# Altium schematic sheet PSU_2.SchDoc: POWER SUPPLY
size A4; Date: 30 08 2013; Author: Rachid AKKOUCHE; CompanyName: MDI; DrawnBy: Rachid AKKOUCHE; Engineer: Rachid AKKOUCHE; Organization: RASoftware; Address1: 52 J03, rue de la crèche; Address2: 77100 MEAUX; Address3: FRANCE; DocumentNumber: BRA201308308C; Revision: C; SheetNumber: 8; SheetTotal: 11; Telephone: +33651604047; Email: rachid.akkouche@wanadoo.fr; Proprietaire: MDI System; Dessinepar: -; Verifiepar: -; Time: 19:00
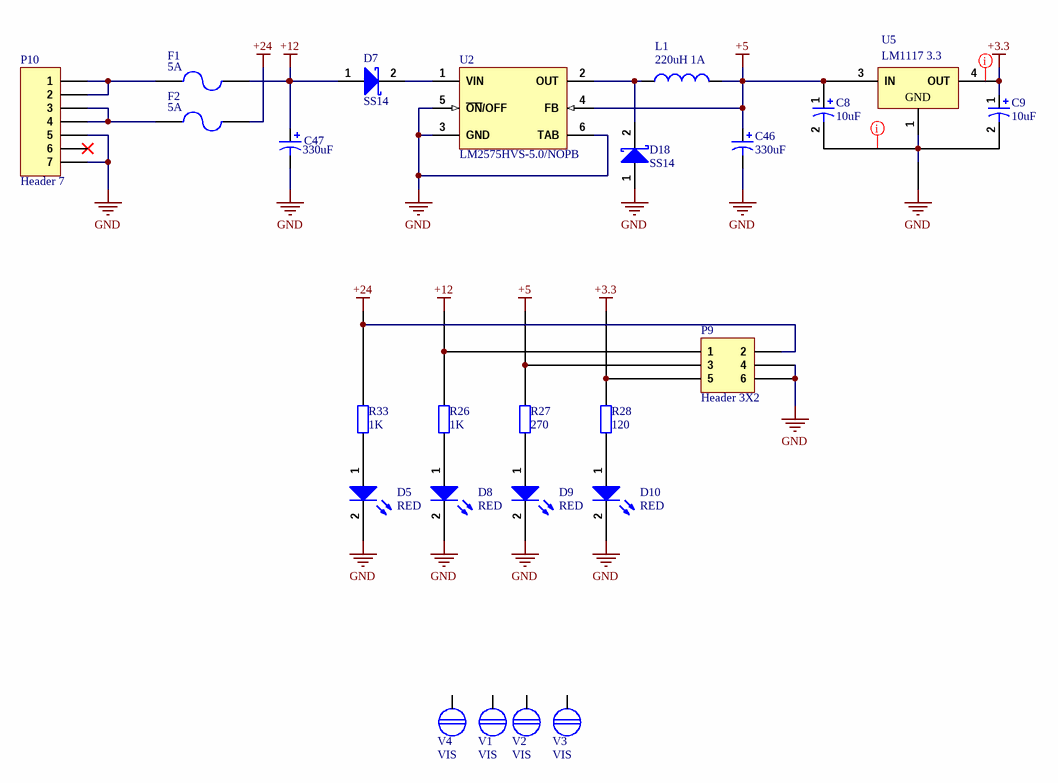
[diagram p0: PSU_2.SchDoc]

## Parts
C8  10uF  [KEMET_4]
C9  10uF  [KEMET_4]
C46  330uF  [Kemet_10]
C47  330uF  [Kemet_10]
D5  Couleur: RED  [0603-LEDR]  (hidden comment: HSMH-C190)
D7  SS14  [DO220AA]
D8  Couleur: RED  [0603-LEDR]  (hidden comment: HSMH-C190)
D9  Couleur: RED  [0603-LEDR]  (hidden comment: HSMH-C190)
D10  Couleur: RED  [0603-LEDR]  (hidden comment: HSMH-C190)
D18  SS14  [DO220AA]
F1  5A  [FUS5X20]
F2  5A  [FUS5X20]
L1  220uH 1A  [Self MCB 18X15]
P9  Header 3X2  [M20-2X3]
P10  Header 7  [CO7P508]
R26  1K  [R0805]
R27  270  [R0805]
R28  120  [R0805]
R33  1K  [R0805]
U2  LM2575HVS-5.0/NOPB  [TO263-5]
U5  LM1117 3.3  [TO252]
V1  VIS  [VIS42]
V2  VIS  [VIS42]
V3  VIS  [VIS42]
V4  VIS  [VIS42]

## Nets
+3.3: C9.1 P9.5 R28.2 U5.4(OUT)
+5: C8.1 C46.1 L1.2 P9.3 R27.2 U2.4(FB) U5.3(IN)
+12: C47.1 D7.1(A) F1.2 P9.1 R26.2
+24: F2.2 P9.2 R33.2
GND: C8.2 C9.2 C46.2 C47.2 D5.2(K) D8.2(K) D9.2(K) D10.2(K) D18.1(A) P9.4 P9.6 P10.5 P10.7 U2.3(GND) U2.5(~{ON}/OFF) U2.6(TAB) U5.1(GND)
NetD5_1: D5.1(A) R33.1
NetD7_2: D7.2(K) U2.1(VIN)
NetD8_1: D8.1(A) R26.1
NetD9_1: D9.1(A) R27.1
NetD10_1: D10.1(A) R28.1
NetD18_2: D18.2(K) L1.1 U2.2(OUT)
NetF1_1: F1.1 P10.1 P10.2
NetF2_1: F2.1 P10.3 P10.4

Not connected (* = marked no-connect by the designer): P10 6*; V1 1; V2 1; V3 1; V4 1

## Layout directives
rule Width Constraint [Pref Width = 0.55mm    Min Width = 0.254mm    Max Width = 2mm]: +3.3, GND

## Notes on the sheet
- Ce document est la propriété de
- Project:
- Il ne peut être divulgué sans l'accord écrit de l'un de ses représentants dûment mandaté
- Title:
- Number:
- Date:
- Time:
- Size:
- A4
- Revision:
- Sheet
- of
- 52 J03 rue de la crèche
- Draw by:
- 77100 Meaux

## Library data of the parts
C8 C9 = Cap Pol1: Polarized Capacitor; Manufacturer: KEMET; Manufacturer Part Number: EXV106M025A9BAA; Supplier 1: Farnell; Supplier Part Number 1: 2069174; RoHS: YES; Pricing 1: 10=0,111, 100=0,085, 500=0,074, 1000=0,07, 5000=0,066 (EUR); ComponentLink1URL: http://www.farnell.com/datasheets/1500293.pdf; ComponentLink1Description: http://www.farnell.com/datasheets/1500293.pdf
C46 C47 = Cap Pol1: Polarized Capacitor (Radial); Manufacturer: KEMET; Manufacturer Part Number: EDK337M025A9PAA; Value: 330uF; Supplier 1: Farnell; Supplier Part Number 1: 2068668; RoHS: YES; Stock 1: 2680; Pricing 1: 10=0,243, 100=0,212, 500=0,191, 1000=0,17, 5000=0,153 (EUR); ComponentLink1URL: http://www.farnell.com/datasheets/1680956.pdf; ComponentLink1Description: http://www.farnell.com/datasheets/1680956.pdf
  C47: Published: 8-Jun-2000; LatestRevisionDate: 17-Jul-2002; LatestRevisionNote: Re-released for DXP Platform.; PackageReference: RB7.6-15; Publisher: Altium Limited; PackageDescription: Polarized Capacitor (Radial); 2 Leads
D5 D8-D10 = HSMH-C190: Surface Mount Chip LED, Red; Manufacturer: AVAGO TECHNOLOGIES; Manufacturer Part Number: HSMH-C190.; Taille de lampe: 0.8mm x 1; Couleur de LED: Rouge; Intensité lumineuse: 17; Angle, vision: 170°; Courant, direct, If: 20; Tension, direct à  If: 1.8; Montage LED: CMS; Forme de lentille: Rectangulaire; Longueur d'onde typ.: 626; SVHC: No SVHC (19-Dec-2012); Dissipation de puissance: 65; Intensité lumineuse min. à  If: 2.8; Intensité lumineuse typique: 10; Largeur (externe): 0.8; Longueur d'onde dominante: 639; Longueur d'onde, crête: 630; Longueur/hauteur: 1.6; Matière: AlGaAs; Nombre de broches: 2; Orientation de montage opto: Dessus; Orientation sortie de lumière: Top Emitting; Température de fonctionnement: -30°C à +85; Température de fonctionnement max..: 85; Température, stockage min.: -40; Température d'utilisation min: -30; Tension, Vf max..: 2.6; Tension, Vf min.: 2.1; Type de LED: Standard; Supplier 1: Farnell; Supplier Part Number 1: 8554641; RoHS: YES; Stock 1: 13902; Pricing 1: 5=0,06, 25=0,059, 100=0,057, 250=0,052, 500=0,047 (EUR); MSL: MSL 2A - 4 semaines; Couleur, LED: Rouge; Profondeur: 0.8; Température, stockage max..: 85; Tension, Vf typ.: 1.8; ComponentLink1URL: http://www.farnell.com/datasheets/313031.pdf; ComponentLink1Description: http://www.farnell.com/datasheets/313031.pdf; ComponentLink2URL: http://www.farnell.com/datasheets/55927.pdf; ComponentLink2Description: http://www.farnell.com/datasheets/55927.pdf
D7 D18 = D Schottky: Schottky Diode
F1 F2 = Fuse 2: Fuse; Manufacturer: KEYSTONE; Manufacturer Part Number: 4527; Fusible 5X20: 1123209; Published: 8-Jun-2000; LatestRevisionDate: 17-Jul-2002; LatestRevisionNote: Re-released for DXP Platform.; PackageReference: PIN-W2/E2.8; Publisher: Altium Limited; PackageDescription: Thru-Hole; 2 Leads; Supplier 1: Farnell; Supplier Part Number 1: 2301274+2301275+1123183; RoHS: YES; Pricing 1: 1=0,59, 250=0,45, 500=0,4, 1000=0,36, 5000=0,33 (EUR); ComponentLink1URL: http://www.keyelco.com/userAssets/file/M60p42.pdf; ComponentLink1Description: http://www.keyelco.com/userAssets/file/M60p42.pdf
L1 = Inductor: Manufacturer: MULTICOMP; Manufacturer Part Number: MCBFS7330-221MU; Gamme de produit: MULTICOMP - MCB Series; Inductance: 220; Tolérance d'Inductance: ± 20%; Construction inductance: Blindé; Résistance DC max.: 0.47; Courant efficace (Irms): 1.2; Type de packaging: Bande découpée; Largeur (externe): 15.24; Longueur/hauteur: 18.54; Nombre de broches: 2; Pas: 12.7; Profondeur: 7.62; Série: MCB<!--FANDB--><div class="features-and-benefits-container"></div>; Supplier 1: Farnell; Supplier Part Number 1: 1864291; RoHS: YES; Stock 1: 2348; Pricing 1: 5=0,37, 50=0,32, 100=0,27, 500=0,25, 1000=0,22 (EUR); Dimensions Boîtier: 18.54mm x 15.24mm x 7.62; ComponentLink1URL: http://www.farnell.com/datasheets/1684913.pdf; ComponentLink1Description: http://www.farnell.com/datasheets/1684913.pdf
P9 = Header 3X2: Header, 3-Pin, Dual row; Manufacturer: TE CONNECTIVITY / AMP; Manufacturer Part Number: 1241050-3; LatestRevisionDate: 17-Jul-2002; LatestRevisionNote: Re-released for DXP Platform.; Publisher: Altium Limited; Supplier 1: Farnell; Supplier Part Number 1: 9689567; RoHS: YES; Pricing 1: 1=1,26, 10=1,22, 50=1,2, 100=1,16 (EUR); ComponentLink1URL: http://www.tycoelectronics.com/commerce/DocumentDelivery/DDEController?Action=srchrtrv&DocNm=1241050-3&DocType=Customer+View+Model&DocLang=English; ComponentLink1Description: http://www.tycoelectronics.com/commerce/DocumentDelivery/DDEController?Action=srchrtrv&DocNm=1241050-3&DocType=Customer+View+Model&DocLang=English; ComponentLink2URL: http://www.te.com/commerce/DocumentDelivery/DDEController?Action=showdoc&DocId=Customer+Drawing%7F1241050%7FA9%7Fpdf%7FEnglish%7FENG_CD_1241050_A9.pdf%7F1241050-5; ComponentLink2Description: http://www.te.com/commerce/DocumentDelivery/DDEController?Action=showdoc&DocId=Customer+Drawing%7F1241050%7FA9%7Fpdf%7FEnglish%7FENG_CD_1241050_A9.pdf%7F1241050-5; ComponentLink3URL: http://www.farnell.com/datasheets/318453.pdf; ComponentLink3Description: http://www.farnell.com/datasheets/318453.pdf
P10 = Header 7: Header, 7-Pin; LatestRevisionDate: 17-Jul-2002; LatestRevisionNote: Re-released for DXP Platform.; Publisher: Altium Limited
R26 R28 R33 = Resistor 0805 1K: Resistor; Manufacturer: MULTICOMP; Manufacturer Part Number: MC0.1W08051%1KFR; Product Range: MULTICOMP - MC Series; Résistance: 1; Puissance: 100; Tolérance de résistance: ± 1%; Type de boîtier de résistance: 0805; Type de résistance: Couche épaisse; Coefficient de température: ± 100; Tension: 150; Type de packaging: Full Reel; Resistor Mounting: CMS; Supplier 1: Farnell; RoHS: YES; Pricing 1: 5000=0,001 (EUR); MSL: MSL 1 - Illimité; ComponentLink1URL: http://www.farnell.com/datasheets/1716700.pdf; ComponentLink1Description: http://www.farnell.com/datasheets/1716700.pdf; Supplier Part Number 1: 2129113
R27 = Resistor 0805 270: Resistor; Manufacturer: MULTICOMP; Manufacturer Part Number: MC01W08051270R; Product Range: MULTICOMP - MC Series; Puissance: 100; Tolérance de résistance: ± 1%; Type de boîtier de résistance: 0805; Type de résistance: Couche épaisse; Coefficient de température: ± 100; Tension: 150; Type de packaging: Full Reel; SVHC: No SVHC (20-Jun-2013); Resistor Mounting: CMS; Supplier 1: Farnell; RoHS: YES; Pricing 1: 5000=0,001 (EUR); Résistance: 270; MSL: (Non Applicable); ComponentLink1URL: http://www.farnell.com/datasheets/1729047.pdf; ComponentLink1Description: http://www.farnell.com/datasheets/1729047.pdf; Supplier Part Number 1: 2129067
U2 = LM2575HVS-5.0/NOPB: SIMPLE SWITCHER® 1A Step-Down Voltage Regulator, 5-pin TO-263, Pb-Free; Manufacturer: National Semiconductor; PackageTopMarking: NSUZXYTTE#*LM2575HVS*-5.0 P+; PowerWise: N; Published: 1-Mar-2010; DatasheetVersion: Apr-2007; PackageVersion: revD, Apr-2005; PackageReference: TS5B; Publisher: Altium Limited; PackageDescription: TO-263, Molded, .400 x .390 x .180in, 5 Lead, .067in Pitch, Surface Mount; Supplier 1: Digi-Key; Supplier Part Number 1: LM2575HVS-5.0-ND; Supplier 2: Farnell; Supplier Part Number 2: 1469170; PartNumber: LM2575HVS-5.0/NOPB; RoHS: Y; PinCount: 5; CompType: Switcher; Code_JEDEC: MO-169-AB; ComponentLink1Description: LM2575HV Datasheet; ComponentLink1URL: http://www.national.com/ds/LM/LM2575HV.pdf; ComponentLink2Description: LM2575HV Web Page; ComponentLink2URL: http://www.national.com/pf/LM/LM2575HV.html; ComponentLink3Description: TS5B Package Page; ComponentLink3URL: http://www.national.com/packaging/folders/ts5b.html
U5 = LM1117DT-3.3: 800mA Low-Dropout Linear Regulator, 3-pin TO-252; Manufacturer: DIODES INC.; Manufacturer Part Number: AP1117D33G-13; Tension d'entrée primaire: 18; Tension de sortie fixe: 3.3; Tension, déclenchement: 1.3; Nombre de broches: 3; Courant, sortie: 1; Température d'utilisation min: 0; Température de fonctionnement max..: 125; SVHC: No SVHC (19-Dec-2012); Racine de la référence: 1117; Température de fonctionnement: 0°C à +125; Supplier 1: Farnell; Supplier Part Number 1: 1825285; RoHS: YES; Stock 1: 2493; Pricing 1: 1=0,23, 10=0,21, 100=0,19, 250=0,181, 500=0,163 (EUR); Type de boîtier CI régulateur de tension: TO-252; Tension, sortie: 3.3; ComponentLink1URL: http://www.farnell.com/datasheets/608751.pdf; ComponentLink1Description: http://www.farnell.com/datasheets/608751.pdf